# Altium schematic sheet [06] - CPU - ETHERNET, SATA.SchDoc
size A2; DocumentNumber: 6; SheetNumber: 6; SheetTotal: 31
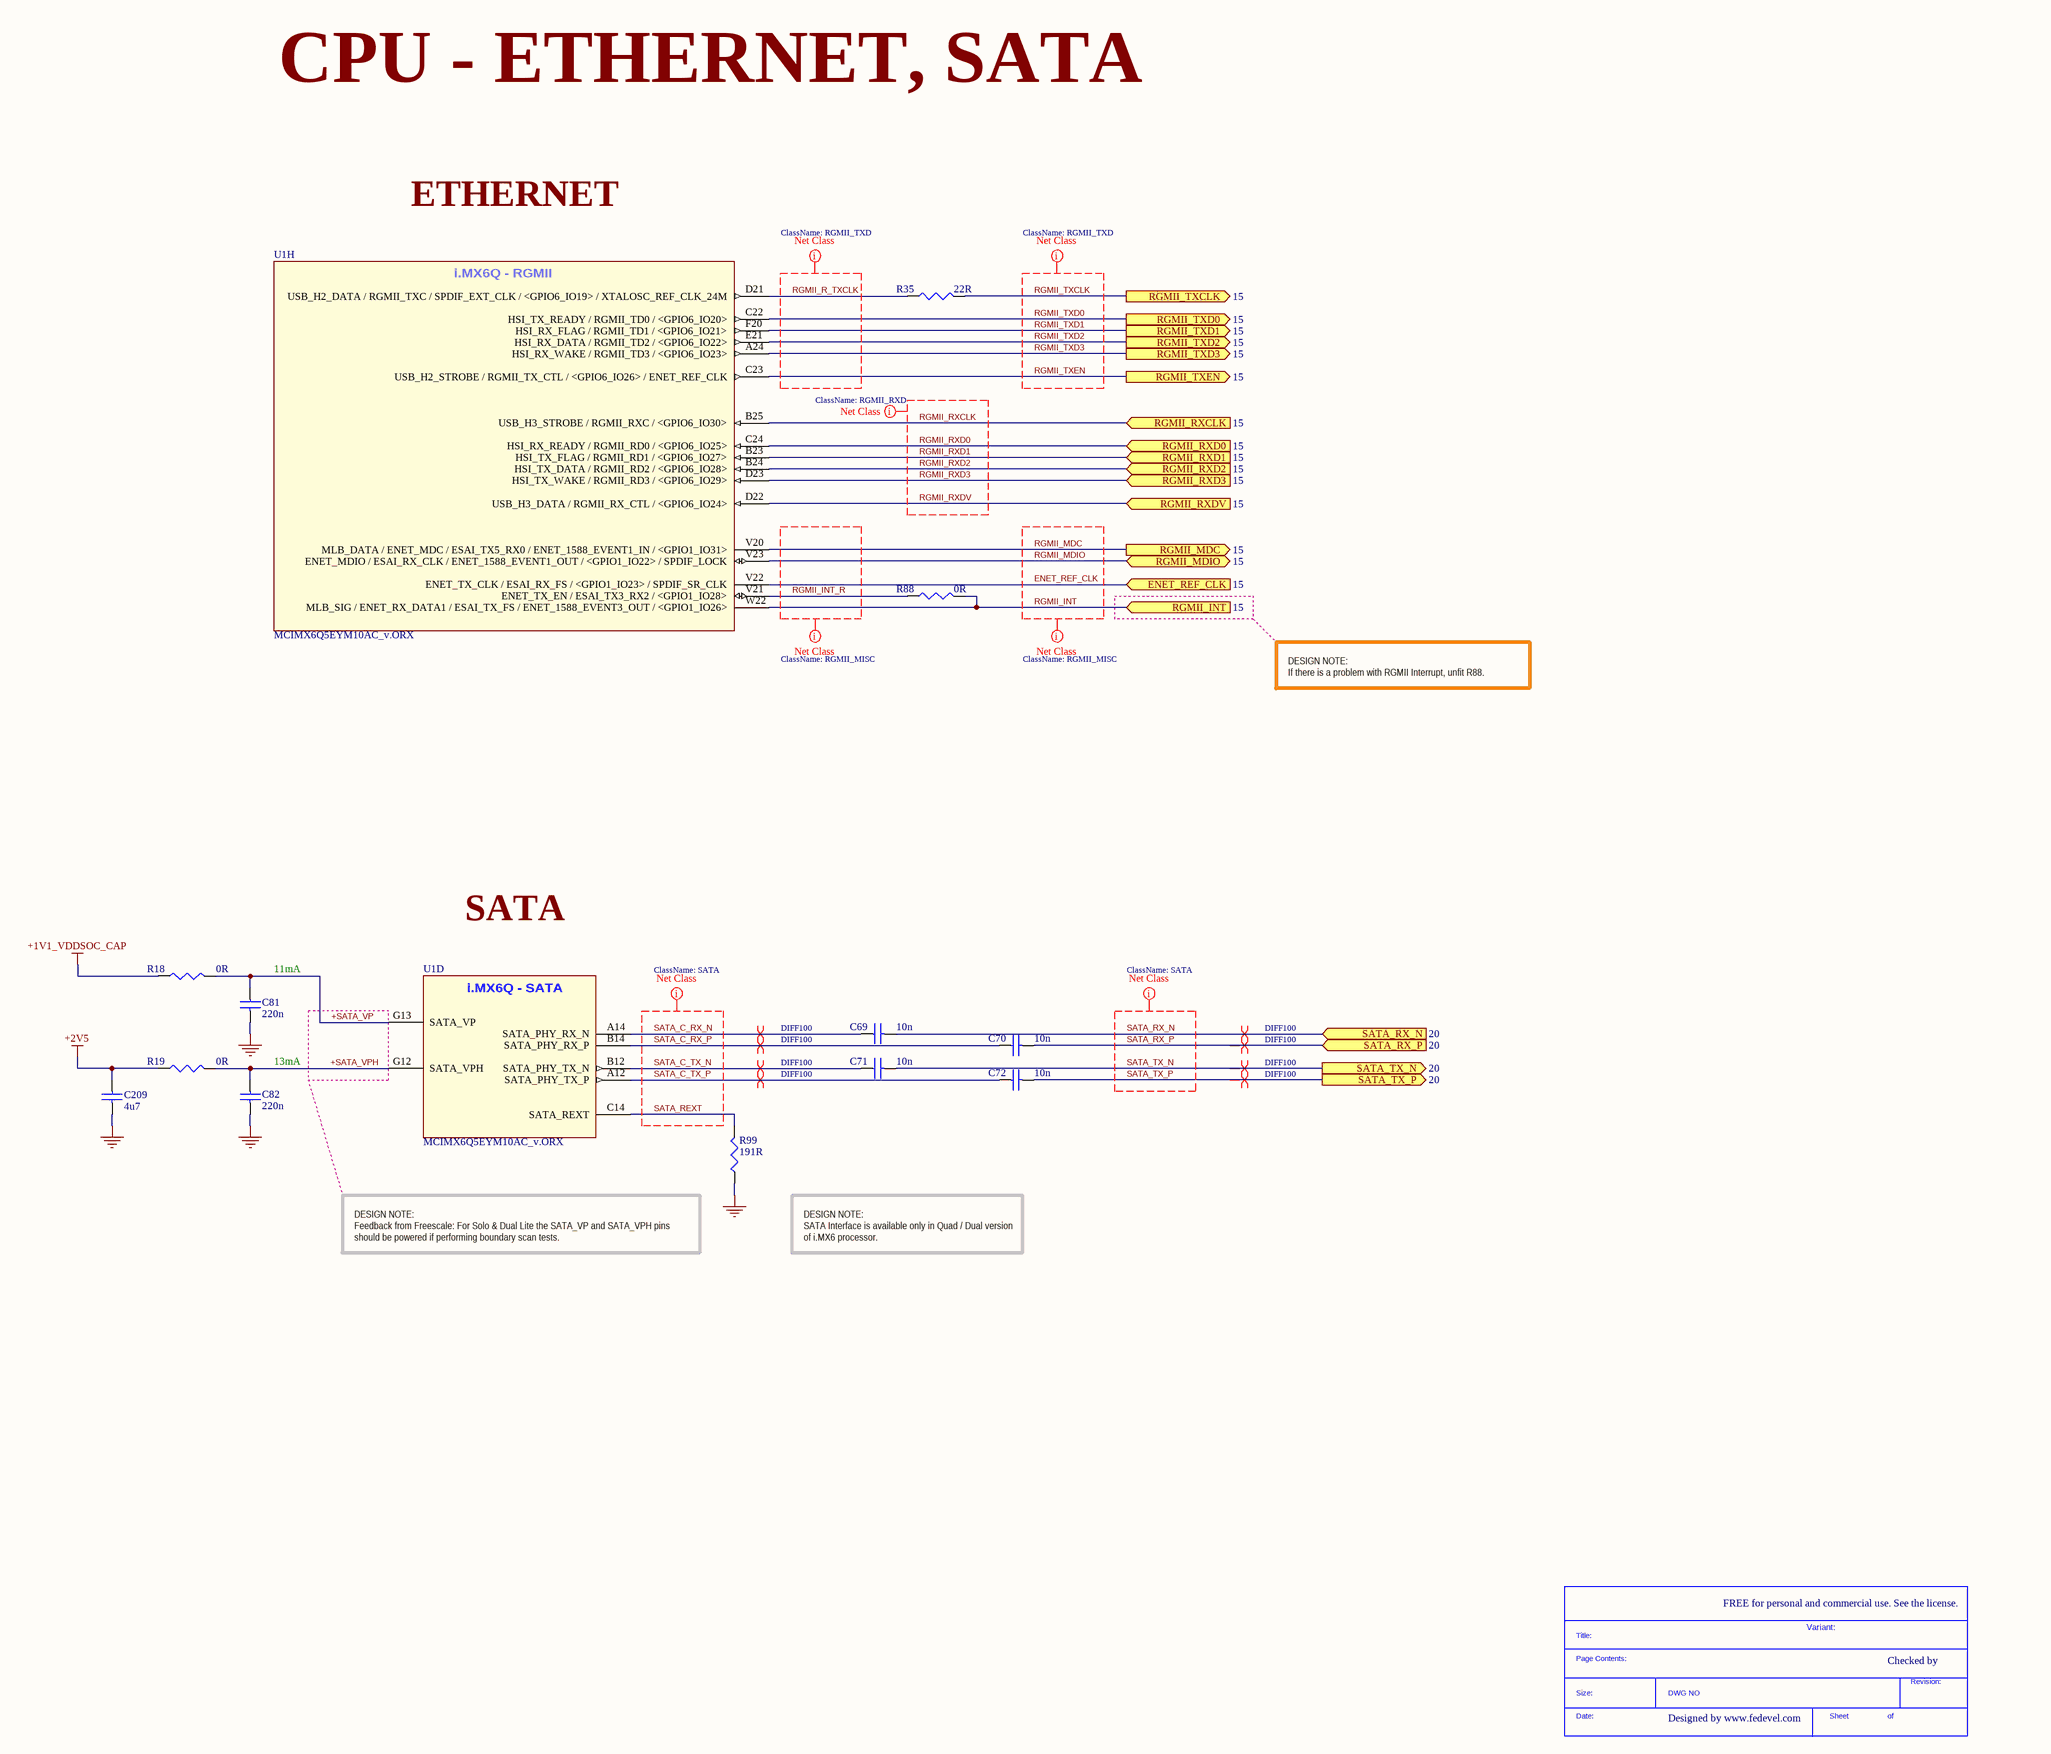
[diagram p0: [06] - CPU - ETHERNET, SATA.SchDoc]

## Parts
*  SDTitleBlock  (value not drawn)  (graphical)
C69  10n  [C0402]
C70  10n  [C0402]
C71  10n  [C0402]
C72  10n  [C0402]
C81  220n  [C0201]
C82  220n  [C0201]
C209  4u7  [C0402]
R18  0R  [R0402]
R19  0R  [R0402]
R35  22R  [R0402]
R88  0R  [R0402]
R99  191R  [R0201]
U1  MCIMX6Q5EYM10AC_v.ORX  [PBGA624]  (parts D,H of 21)

## Ports
ENET_REF_CLK (in, see 15), RGMII_INT (in, see 15), RGMII_MDC (out, see 15), RGMII_MDIO (bidir, see 15), RGMII_RXCLK (in, see 15), RGMII_RXD0 (in, see 15), RGMII_RXD1 (in, see 15), RGMII_RXD2 (in, see 15), RGMII_RXD3 (in, see 15), RGMII_RXDV (in, see 15), RGMII_TXCLK (out, see 15), RGMII_TXD0 (out, see 15), RGMII_TXD1 (out, see 15), RGMII_TXD2 (out, see 15), RGMII_TXD3 (out, see 15), RGMII_TXEN (out, see 15), SATA_RX_N (in, see 20), SATA_RX_P (in, see 20), SATA_TX_N (out, see 20), SATA_TX_P (out, see 20)

## Nets
+1V1_VDDSOC_CAP: R18.1
+2V5: C209.1 R19.1
GND: C81.2 C82.2 C209.2 R99.1
+SATA_VP: C81.1 R18.2 U1.G13(SATA_VP)
+SATA_VPH: C82.1 R19.2 U1.G12(SATA_VPH)
ENET_REF_CLK: U1.V22(ENET_TX_CLK_/_ESAI_RX_FS_/_<GPIO1_IO23>_/_SPDIF_SR_CLK) ; port ENET_REF_CLK
RGMII_INT: R88.2 U1.W22(MLB_SIG_/_ENET_RX_DATA1_/_ESAI_TX_FS_/_ENET_1588_EVENT3_OUT_/_<GPIO1_IO26>) ; port RGMII_INT
RGMII_INT_R: R88.1 U1.V21(ENET_TX_EN_/_ESAI_TX3_RX2_/_<GPIO1_IO28>)
RGMII_MDC: U1.V20(MLB_DATA_/_ENET_MDC_/_ESAI_TX5_RX0_/_ENET_1588_EVENT1_IN_/_<GPIO1_IO31>) ; port RGMII_MDC
RGMII_MDIO: U1.V23(ENET_MDIO_/_ESAI_RX_CLK_/_ENET_1588_EVENT1_OUT_/_<GPIO1_IO22>_/_SPDIF_LOCK) ; port RGMII_MDIO
RGMII_R_TXCLK: R35.1 U1.D21(USB_H2_DATA_/_RGMII_TXC_/_SPDIF_EXT_CLK_/_<GPIO6_IO19>_/_XTALOSC_REF_CLK_24M)
RGMII_RXCLK: U1.B25(USB_H3_STROBE_/_RGMII_RXC_/_<GPIO6_IO30>) ; port RGMII_RXCLK
RGMII_RXD0: U1.C24(HSI_RX_READY_/_RGMII_RD0_/_<GPIO6_IO25>) ; port RGMII_RXD0
RGMII_RXD1: U1.B23(HSI_TX_FLAG_/_RGMII_RD1_/_<GPIO6_IO27>) ; port RGMII_RXD1
RGMII_RXD2: U1.B24(HSI_TX_DATA_/_RGMII_RD2_/_<GPIO6_IO28>) ; port RGMII_RXD2
RGMII_RXD3: U1.D23(HSI_TX_WAKE_/_RGMII_RD3_/_<GPIO6_IO29>) ; port RGMII_RXD3
RGMII_RXDV: U1.D22(USB_H3_DATA_/_RGMII_RX_CTL_/_<GPIO6_IO24>) ; port RGMII_RXDV
RGMII_TXCLK: R35.2 ; port RGMII_TXCLK
RGMII_TXD0: U1.C22(HSI_TX_READY_/_RGMII_TD0_/_<GPIO6_IO20>) ; port RGMII_TXD0
RGMII_TXD1: U1.F20(HSI_RX_FLAG_/_RGMII_TD1_/_<GPIO6_IO21>) ; port RGMII_TXD1
RGMII_TXD2: U1.E21(HSI_RX_DATA_/_RGMII_TD2_/_<GPIO6_IO22>) ; port RGMII_TXD2
RGMII_TXD3: U1.A24(HSI_RX_WAKE_/_RGMII_TD3_/_<GPIO6_IO23>) ; port RGMII_TXD3
RGMII_TXEN: U1.C23(USB_H2_STROBE_/_RGMII_TX_CTL_/_<GPIO6_IO26>_/_ENET_REF_CLK) ; port RGMII_TXEN
SATA_C_RX_N: C69.1 U1.A14(SATA_PHY_RX_N)
SATA_C_RX_P: C70.1 U1.B14(SATA_PHY_RX_P)
SATA_C_TX_N: C71.1 U1.B12(SATA_PHY_TX_N)
SATA_C_TX_P: C72.1 U1.A12(SATA_PHY_TX_P)
SATA_REXT: R99.2 U1.C14(SATA_REXT)
SATA_RX_N: C69.2 ; port SATA_RX_N
SATA_RX_P: C70.2 ; port SATA_RX_P
SATA_TX_N: C71.2 ; port SATA_TX_N
SATA_TX_P: C72.2 ; port SATA_TX_P

## Layout directives
net class RGMII_MISC: ENET_REF_CLK, RGMII_INT, RGMII_INT_R, RGMII_MDC, RGMII_MDIO
net class RGMII_TXD: RGMII_R_TXCLK, RGMII_TXCLK, RGMII_TXD0, RGMII_TXD1, RGMII_TXD2, RGMII_TXD3, RGMII_TXEN
net class RGMII_RXD: RGMII_RXCLK, RGMII_RXD0, RGMII_RXD1, RGMII_RXD2, RGMII_RXD3, RGMII_RXDV
differential pair; net class DIFF100: SATA_C_RX_N, SATA_C_RX_P, SATA_C_TX_N, SATA_C_TX_P, SATA_RX_N, SATA_RX_P, SATA_TX_N, SATA_TX_P
net class SATA: SATA_C_RX_N, SATA_C_RX_P, SATA_C_TX_N, SATA_C_TX_P, SATA_REXT, SATA_RX_N, SATA_RX_P, SATA_TX_N, SATA_TX_P

## Notes on the sheet
- CPU - ETHERNET, SATA
- ETHERNET
- DESIGN NOTE:
  If there is a problem with RGMII Interrupt, unfit R88.
- SATA
- (near C81) 11mA
- 13mA
- DESIGN NOTE:
  Feedback from Freescale: For Solo & Dual Lite the SATA_VP and SATA_VPH pins should be powered if performing boundary scan tests.
- DESIGN NOTE:
  SATA Interface is available only in Quad / Dual version of i.MX6 processor.
- FREE for personal and commercial use. See the license.
- Variant:
- Checked by
- Designed by www.fedevel.com
- (in symbol MCIMX6Q5EYM10AC_v.ORX, part D) i.MX6Q - SATA
- (in symbol MCIMX6Q5EYM10AC_v.ORX, part H) i.MX6Q - RGMII
- (in symbol SDTitleBlock) Title:; Page Contents:; Revision:; Size:; DWG NO; Date:; Sheet; of

## Library data of the parts
C69-C72 = C1005X7R1H103K: CAP CER 10000PF 50V 10% X7R 0402; Manufacturer: TDK Corporation; Value: 10nF; .Checked PCB: used; Capacitance: 10000pF; Category: Capacitors; Supplier Part Number: 445-6850-1-ND; Manufacturer Part Number: C1005X7R1H103K; Operating Temperature: -55°C ~ 125°C; Package / Case: 0402 (1005 Metric); Price 1k [$]: 0.01625; .Checked SCH: used; Voltage - Rated: 50V; Supplier: Digikey; Supplier 1: Digi-Key; Supplier Part Number 1: 445-6850-1-ND; RoHS: RoHS Compliant; Stock 1: 3901; Pricing 1: 1=0.2, 10=0.125, 100=0.045, 250=0.03252, 500=0.024, 1000=0.01625 (USD); Tolerance: ±10%; Temperature Coefficient: X7R; Mounting Type: Surface Mount, MLCC; Applications: General Purpose; Ratings: -; Size / Dimension: 0.039" L x 0.020" W (1.00mm x 0.50mm); Height - Seated (Max): -; Thickness (Max): 0.022" (0.55mm); Lead Spacing: -; Features: -; Packaging: Cut Tape (CT); Lead Style: -; ComponentLink1URL: http://www.tdk.co.jp/tefe02/e412_c.pdf; ComponentLink1Description: http://www.tdk.co.jp/tefe02/e412_c.pdf
C81 C82 = C0603X5R0J224M030BB: CAP CER 0.22UF 6.3V 20% X5R 0201; Manufacturer: TDK Corporation; Capacitance: 0.22µF; .Checked PCB: MM; Supplier 1: Digi-Key; Manufacturer Part Number: C0603X5R0J224M030BB; RoHS: RoHS Compliant; Category: Capacitors; Stock 1: 205900; Pricing 1: 1=0.15, 10=0.102, 100=0.0485, 250=0.0408, 500=0.03418, 1000=0.0275, 5000=0.02325 (USD); Packaging: Cut Tape (CT); Tolerance: ±20%; Voltage - Rated: 6.3V; Temperature Coefficient: X5R; Mounting Type: Surface Mount, MLCC; Operating Temperature: -55°C ~ 85°C; Applications: General Purpose; Ratings: -; Package / Case: 0201 (0603 Metric); Size / Dimension: 0.024" L x 0.012" W (0.60mm x 0.30mm); Height - Seated (Max): -; Thickness (Max): 0.013" (0.33mm); Lead Spacing: -; Features: -; Lead Style: -; ComponentLink1URL: http://product.tdk.com/en/catalog/datasheets/mlcc_commercial_general_en.pdf; ComponentLink1Description: http://product.tdk.com/en/catalog/datasheets/mlcc_commercial_general_en.pdf; Supplier Part Number 1: 445-5929-1-ND; .Checked SCH: MM; .Creator: MM
C209 = C1005X5R1A475M: CAP CER 4.7UF 10V 20% X5R 0402; Manufacturer: TDK Corporation; Capacitance: 4.7µF; .Checked PCB: used; Supplier 1: Digi-Key; Supplier Part Number 1: 445-8023-1-ND; Manufacturer Part Number: C1005X5R1A475M; RoHS: RoHS Compliant; Category: Capacitors; Stock 1: 10140; Pricing 1: 1=0.53, 10=0.415, 100=0.25, 250=0.18752, 500=0.16, 1000=0.125, 5000=0.095 (USD); Voltage - Rated: 10V; Tolerance: ±20%; Temperature Coefficient: X5R; Mounting Type: Surface Mount, MLCC; Operating Temperature: -55°C ~ 85°C; Applications: General Purpose; Ratings: -; Package / Case: 0402 (1005 Metric); Size / Dimension: 0.039" L x 0.020" W (1.00mm x 0.50mm); Height - Seated (Max): -; Thickness (Max): -; Lead Spacing: -; Features: -; Packaging: Cut Tape (CT); Lead Style: -; ComponentLink1URL: http://www.tdk.com/pdf/general_B11.pdf; ComponentLink1Description: http://www.tdk.com/pdf/general_B11.pdf; .Checked SCH: used
R18 R19 R88 = RC0402JR-070RL: RES 0.0 OHM 1/16W 0402 SMD; Manufacturer: Yageo; Resistance (Ohms): 0.0; Power (Watts): 0.063W, 1/16W; Tolerance: Jumper; .Checked PCB: used; Category: Resistors; Supplier Part Number: 311-0.0JRCT-ND; Manufacturer Part Number: RC0402JR-070RL; Package / Case: 0402 (1005 Metric); Price 1k [$]: 0.01389; Value: 0R; .Checked SCH: used; Supplier: Digikey; Supplier 1: Digi-Key; Supplier Part Number 1: 311-0.0JRCT-ND; RoHS: RoHS Compliant; Stock 1: 1106330; Pricing 1: 10=0.012, 50=0.009, 100=0.0069, 250=0.00512, 500=0.0038, 1000=0.00253 (USD); Composition: Thick Film; Features: -; Temperature Coefficient: -; Size / Dimension: 0.039" L x 0.020" W (1.00mm x 0.50mm); Height: 0.016" (0.40mm); Number of Terminations: 2; Packaging: Cut Tape (CT); ComponentLink1URL: http://www.yageo.com/documents/recent/PYu-RC0402_51_RoHS_L_6.pdf; ComponentLink1Description: http://www.yageo.com/documents/recent/PYu-RC0402_51_RoHS_L_6.pdf
R35 = RC0402FR-0722RL: RES 22.0 OHM 1/16W 1% 0402 SMD; Manufacturer: Yageo; Resistance (Ohms): 22; Power (Watts): 0.063W, 1/16W; .Checked PCB: used; Temperature Coefficient: ±100ppm/°C; Category: Resistors; Supplier Part Number: 311-22.0LRCT-ND; Manufacturer Part Number: RC0402FR-0722RL; Package / Case: 0402 (1005 Metric); Price 1k [$]: 0.01421; Tolerance: ±1%; Value: 22R; .Checked SCH: used; Supplier: Digikey; Supplier 1: Digi-Key; Supplier Part Number 1: 311-22.0LRCT-ND; RoHS: RoHS Compliant; Stock 1: 943800; Pricing 1: 10=0.014, 50=0.0104, 100=0.0079, 250=0.00584, 500=0.00432, 1000=0.00288 (USD); Composition: Thick Film; Features: -; Size / Dimension: 0.039" L x 0.020" W (1.00mm x 0.50mm); Height: 0.016" (0.40mm); Number of Terminations: 2; Packaging: Cut Tape (CT); ComponentLink1URL: http://www.yageo.com/documents/recent/PYu-RC0402_51_RoHS_L_6.pdf; ComponentLink1Description: http://www.yageo.com/documents/recent/PYu-RC0402_51_RoHS_L_6.pdf
R99 = ERJ-1GEF1910C: RES 191 OHM 1/20W 1% 0201 SMD; Manufacturer: Panasonic Electronic Components; Resistance (Ohms): 191; Power (Watts): 0.05W, 1/20W; Temperature Coefficient: ±200ppm/°C; .Creator: MM; Supplier 1: Digi-Key; Manufacturer Part Number: ERJ-1GEF1910C; RoHS: RoHS Compliant; Category: Resistors; Stock 1: 34157; Pricing 1: 1=0.11, 50=0.0414, 100=0.0315, 250=0.0234, 500=0.01728, 1000=0.01152, 5000=0.0081 (USD); Packaging: Cut Tape (CT); Tolerance: ±1%; Composition: Thick Film; Features: -; Package / Case: 0201 (0603 Metric); Supplier Device Package: 0201; Size / Dimension: 0.024" L x 0.012" W (0.60mm x 0.30mm); Height: 0.010" (0.26mm); Number of Terminations: 2; ComponentLink1URL: http://media.digikey.com/pdf/Data%20Sheets/Panasonic%20Resistors%20Thermistors%20PDFs/ERJ_G,R,E_Rev08.pdf; ComponentLink1Description: http://media.digikey.com/pdf/Data%20Sheets/Panasonic%20Resistors%20Thermistors%20PDFs/ERJ_G,R,E_Rev08.pdf; Supplier Part Number 1: P191ABCT-ND; .Checked PCB: MM; .Checked SCH: MM
U1 = MCIMX6Q5EYM10AC_v.ORX: IC MCU 32BIT ARM QUAD 624FCBGA; Manufacturer: Freescale Semiconductor; Speed: 1.0GHz; .Creator: MM; .Checked PCB: MM, checked by RF; Core Processor: ARM® Cortex™-A9; Core Size: 32-Bit Quad-Core; Connectivity: CAN, EBI/EMI, ESAI, Ethernet, GPMI, I2C, MMC/SD, PCI, SATA, SPI, UART, USB, USB OTG; Peripherals: DMA, HDMI, I2S/SSI/AC97, MIPI CSI, MIMI DSI, MIPI HIS, PWM, WDT; Number of I /O: 224; Program Memory Type: External Program Memory; RAM Size: 256K x 8; Voltage - Supply (Vcc/Vdd): 0.925 V ~ 1.5 V; Oscillator Type: Internal; Supplier 1: Digi-Key; Manufacturer Part Number: MCIMX6Q5EYM10AC; RoHS: RoHS Compliant; Category: Integrated Circuits (ICs); Stock 1: 0; Pricing 1: 1=54.98, 10=51.922, 25=48.868, 100=30.5424 (USD); Packaging: Tray; Package / Case: 624-FBGA, FCBGA; ComponentLink1URL: http://cache.freescale.com/files/32bit/doc/data_sheet/IMX6DQCEC.pdf; ComponentLink1Description: http://cache.freescale.com/files/32bit/doc/data_sheet/IMX6DQCEC.pdf; Supplier Part Number 1: MCIMX6Q5EYM10AC-ND; Program Memory Size: -; EEPROM Size: -; Data Converters: -; Operating Temperature: -20°C ~ 105°C